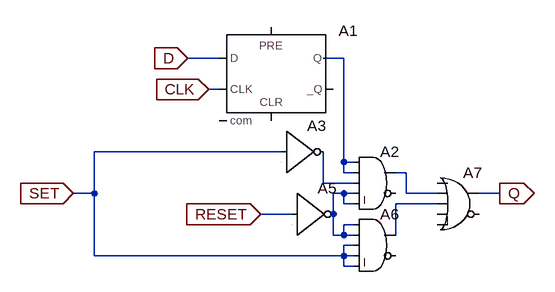
[diagram p0: schematic D_FF_SR.asc]
D_FF_SR.asc, the LTspice schematic file:
Version 4
SHEET 1 1572 680
WIRE 368 -32 320 -32
WIRE 560 -32 528 -32
WIRE 368 16 352 16
WIRE 464 112 176 112
WIRE 560 128 560 -32
WIRE 576 128 560 128
WIRE 560 144 560 128
WIRE 576 144 560 144
WIRE 656 144 640 144
WIRE 528 160 528 112
WIRE 576 160 528 160
WIRE 176 176 176 112
WIRE 176 176 144 176
WIRE 560 176 544 176
WIRE 576 176 560 176
WIRE 656 176 656 144
WIRE 704 176 656 176
WIRE 800 176 768 176
WIRE 560 192 560 176
WIRE 576 192 560 192
WIRE 704 192 640 192
WIRE 480 208 432 208
WIRE 544 208 544 176
WIRE 576 224 560 224
WIRE 544 240 544 208
WIRE 560 240 560 224
WIRE 560 240 544 240
WIRE 576 240 560 240
WIRE 640 240 640 192
WIRE 576 256 560 256
WIRE 176 272 176 176
WIRE 560 272 560 256
WIRE 560 272 176 272
WIRE 576 272 560 272
WIRE 560 288 560 272
WIRE 576 288 560 288
FLAG 320 -32 D
IOPIN 320 -32 In
FLAG 352 16 CLK
IOPIN 352 16 In
FLAG 144 176 SET
IOPIN 144 176 In
FLAG 432 208 RESET
IOPIN 432 208 In
FLAG 800 176 Q
IOPIN 800 176 Out
SYMBOL Digital\\dflop 448 -80 R0
SYMATTR InstName A1
SYMATTR SpiceLine td=0.9n
SYMBOL Digital\\and 608 96 R0
SYMATTR InstName A2
SYMATTR SpiceLine 0.05n
SYMBOL Digital\\inv 464 48 R0
SYMATTR InstName A3
SYMBOL Digital\\inv 480 144 R0
SYMATTR InstName A5
SYMBOL Digital\\and 608 192 R0
SYMATTR InstName A6
SYMBOL Digital\\or 736 128 R0
SYMATTR InstName A7

The netlist it stands for:
* D_FF_SR.asc
A1 D 0 CLK 0 0 0 N001 0 DFLOP td=0.9n
A2 N001 N001 N003 N004 N004 0 N002 0 AND 0.05n
A3 SET 0 0 0 0 N003 0 0 BUF
A5 RESET 0 0 0 0 N004 0 0 BUF
A6 N004 N004 SET SET SET 0 N005 0 AND
A7 0 N002 N005 0 0 0 Q 0 OR
.backanno
.end